# Altium project Stairs LED DCDC.PrjPcb
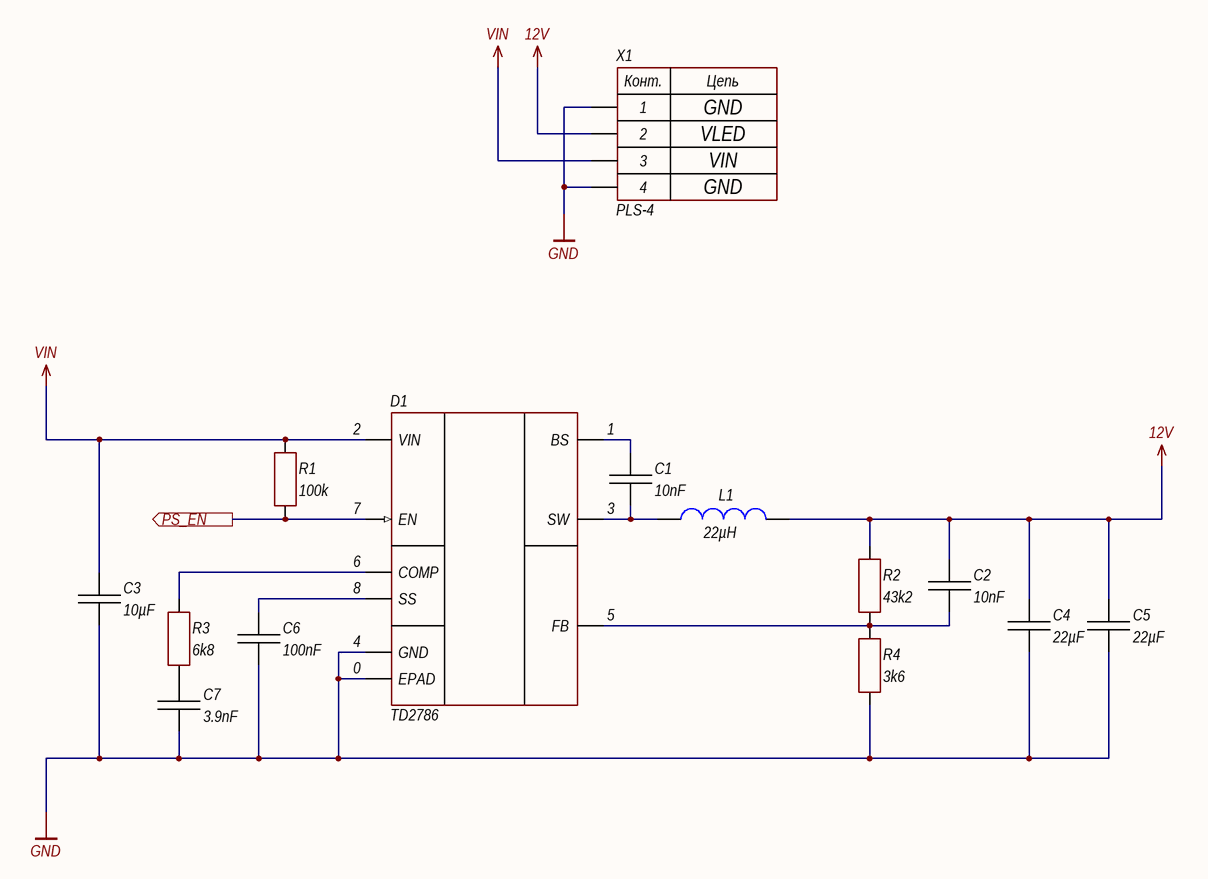
[diagram p0: Board-DCDC.SchDoc]
ProjectAuthor: Clark A.; ProjectCompanyName: Azek Clark © 2020; ProjectDate: 03.11.2020; ProjectNumber: StairsLED-DCDC; ProjectRevision: 001; ProjectShortDate: 2020.11; ProjectTitle: DCDC module for main board
1 sheet, 14 parts. Net scope: flat (ports and power ports of the same name join across sheets).
Board file: PCB-DCDC.PcbDoc

## Sheet Board-DCDC.SchDoc: =ProjectTitle
size 840 x 594 mm; Author: Clark A.; CompanyName: Azek Clark © 2020; Address1: Address1; Address2: Address2; Address3: Address3; Address4: Address4; DocumentNumber: StairsLED-DCDC 001; SheetNumber: 1; SheetTotal: 1; Scale: 1:1; DocumentType: Схема электрическая принципиальная; FirstReferrence: StairsLED-DCDC; Title2str: ?

### Parts
C1  10nF  [CH0402C]
C2  10nF  [CH0402C]
C3  10µF  [CH1210C]
C4  22µF  [CH1210C]
C5  22µF  [CH1210C]
C6  100nF  [CH0402C]
C7  3.9nF  [CH0402C]
D1  TD2786  [8-SOIC (PAD)]
L1  22µH  [IND: JSHC1040]
R1  100k  [CH0402R]
R2  43k2  [CH0402R]
R3  6k8  [CH0402R]
R4  3k6  [CH0402R]
X1  PLS-4  [CON: PLS-4]

### Ports
PS_EN (out)

### Nets
12V: C2.2 C4.2 C5.2 L1.1 R2.2 X1.2
GND: C3.1 C4.1 C5.1 C6.1 C7.1 D1.0(EPAD) D1.4(GND) R4.1 X1.1 X1.4
VIN: C3.2 D1.2(VIN) R1.2 X1.3
NetC1_1: C1.1 D1.3(SW) L1.2
NetC1_2: C1.2 D1.1(BS)
NetC2_1: C2.1 D1.5(FB) R2.1 R4.2
NetC6_2: C6.2 D1.8(SS)
NetC7_2: C7.2 R3.1
NetD1_6: D1.6(COMP) R3.2
NetD1_7: D1.7(EN) R1.1 ; port PS_EN

### Notes on the sheet
- GND
- VIN
- VLED
- Разраб.
- Изм.
- Лист
- № докум.
- Подп.
- Дата
- Лит.
- Масса
- Масштаб
- Пров.
- Т.контр.
- Листов
- Утв.
- Н.контр.
- 2.106-A1
- Копировал
- Формат А1
- (in symbol 4-Connector) Конт.; Цепь

### Library data of the parts
C1 C2 = Capacitor: Manufacturer: CCTC; Model: TCC0402X7R103M500AT; HelpURL: https://lcsc.com/product-detail/Multilayer-Ceramic-Capacitors-MLCC-SMD-SMT_CCTC-TCC0402X7R103M500AT_C696856.html; ComponentKind: X7R, 50V; Value: 10nF
C3 = Capacitor: Manufacturer: Murata Electronics; Model: GRM32ER71H106KA12L; HelpURL: https://lcsc.com/product-detail/Multilayer-Ceramic-Capacitors-MLCC-SMD-SMT_Murata-Electronics-GRM32ER71H106KA12L_C77102.html; ComponentKind: X7R, 50V; Value: 10µF
C4 C5 = Capacitor: Manufacturer: Murata Electronics; Model: GRM32ER71E226KE15L; HelpURL: https://lcsc.com/product-detail/Multilayer-Ceramic-Capacitors-MLCC-SMD-SMT_Murata-Electronics-GRM32ER71E226KE15L_C21397.html; ComponentKind: X7R, 25V; Value: 22µF
C6 = Capacitor: Manufacturer: CCTC; Model: TCC0402X7R104K250AT; HelpURL: https://lcsc.com/product-detail/Multilayer-Ceramic-Capacitors-MLCC-SMD-SMT_CCTC-TCC0402X7R104K250AT_C466234.html; ComponentKind: X7R, 50V; Value: 100nF
C7 = Capacitor: Manufacturer: YAGEO; Model: CC0402KRX7R9BB392; HelpURL: https://lcsc.com/product-detail/Multilayer-Ceramic-Capacitors-MLCC-SMD-SMT_YAGEO-CC0402KRX7R9BB392_C113790.html; ComponentKind: X7R, 50V; Value: 3.9nF
D1 = TD2786: Step-down; Manufacturer: Techcode Semiconductor Limited; Model: TD2786; HelpURL: https://lcsc.com/product-detail/DC-DC-Converters_Techcode-Semicon-TD2786MR_C89599.html; ComponentKind: 30V, 3A
L1 = Inductor: Manufacturer: Jinlai; Model: JSHC1040H-220M-G; HelpURL: https://datasheet.lcsc.com/szlcsc/1912111437_Jinlai-JSHC1040H-220M-G_C334107.pdf; ComponentKind: 55mOhm, 3.5A; Value: 22µH
R1 = Resistor: Manufacturer: Uniroyal Elec; Model: 0402WGF1003TCE; HelpURL: https://lcsc.com/product-detail/Chip-Resistor-Surface-Mount_UNI-ROYAL-Uniroyal-Elec-0402WGF1003TCE_C25741.html; ComponentKind: ±1%; Value: 100k
R2 = Resistor: Manufacturer: YAGEO; Model: RC0402FR-0743K2L; HelpURL: https://lcsc.com/product-detail/Chip-Resistor-Surface-Mount_YAGEO-RC0402FR-0743K2L_C137980.html; ComponentKind: ±1%; Value: 43k2
R3 = Resistor: Manufacturer: Uniroyal Elec; Model: 0402WGF6801TCE; HelpURL: https://lcsc.com/product-detail/Chip-Resistor-Surface-Mount_UNI-ROYAL-Uniroyal-Elec-0402WGF6801TCE_C25917.html; ComponentKind: ±1%; Value: 6k8
R4 = Resistor: Manufacturer: YAGEO; Model: AC0402FR-073K6L; HelpURL: https://lcsc.com/product-detail/Chip-Resistor-Surface-Mount_YAGEO-AC0402FR-073K6L_C227042.html; ComponentKind: ±1%; Value: 3k6
X1 = 4-Connector: Model: PLS-4; Manufacturer: *; HelpURL: *; ComponentKind: *; System: Connector